# Altium schematic sheet Pg9-Hardware.SchDoc: Hardware - MIiscellaneous
size 431 x 279 mm; Date: Not shown in title block; ApprovedBy: Not shown in title block; CheckedBy: Not shown in title block; Author: Not shown in title block; CompanyName: Not shown in title block; Engineer: Not shown in title block; Organization: Not shown in title block; Address1: Not shown in title block; Address2: Not shown in title block; Address3: Not shown in title block; Address4: Not shown in title block; DocumentNumber: 7; Revision: Use project parameter SCH_Rev; SheetNumber: 9; SheetTotal: 9; PageSetup: Record=PageOptions|CenterHorizontal=True|CenterVertical=True|PrintScale=0.62|XCorrection=1.00|YCorrection=1.00|PrintKind=0|BorderSize=5000000|LeftOffset=0|BottomOffset=0|Orientation=2|PaperLength=1000|PaperWidth=1000|Scale=100|PaperSource=15|PrintQuality=600|MediaType=1|DitherType=10|PaperKind=Letter|PrintScaleMode=1; CurrentTime: Not shown in title block; CurrentDate: Not shown in title block; Time: Not shown in title block; DocumentFullPathAndName: Not shown in title block; DocumentName: Not shown in title block; ModifiedDate: Not shown in title block; ImagePath: Not shown in title block
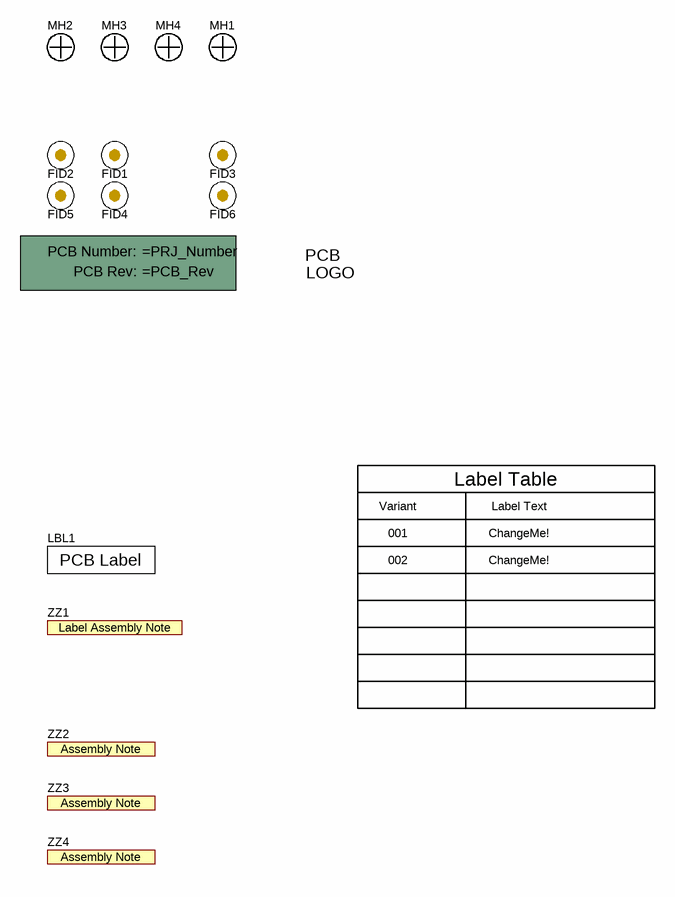
[diagram p0: Pg9-Hardware.SchDoc]

## Parts
!PCB1  (no value)  (mechanical)
FID1  (no value)  [Fiducial10-20]
FID2  (no value)  [Fiducial10-20]
FID3  (no value)  [Fiducial10-20]
FID4  (no value)  [Fiducial10-20]
FID5  (no value)  [Fiducial10-20]
FID6  (no value)  [Fiducial10-20]
LBL1  (no value)  [Label_650x200]
Logo1  (no value)  [TI_Stacked_SolderMask_Small]  (no BOM)
MH1  (no value)  [MH3.2]
MH2  (no value)  [MH3.2]
MH3  (no value)  [MH3.2]
MH4  (no value)  [MH3.2]
ZZ1  (no value)  [AssemblyNoteLabel]  (no BOM)
ZZ2  (no value)  [AssemblyNote]  (no BOM)
ZZ3  (no value)  [AssemblyNote]  (no BOM)
ZZ4  (no value)  [AssemblyNote]  (no BOM)

## Notes on the sheet
- Variant
- Label Table
- Label Text
- 001
- 002
- ChangeMe!
- Drawn By:
- SVN Rev:
- Number:
- Rev:
- Sheet Title:
- File:
- Project Title:
- Designed for:
- Assembly Variant:
- Mod. Date:
- Sheet:
- Size:
- of
- B
- http://www.ti.com
- Texas Instruments and/or its licensors do not warrant the accuracy or completeness of this specification or any information contained therein. Texas Instruments and/or its licensors do not warrant that this design will meet the specifications, will be suitable for your application or fit for any particular purpose, or will operate in an implementation. Texas Instruments and/or its licensors do not warrant that the design is production worthy. You should completely validate and test your design implementation to confirm the system functionality for your application.
- Engineer:
- Contact:
- © Texas Instruments
- (in symbol AssemblyNote) Assembly Note
- (in symbol AssemblyNoteLabel) Label Assembly Note
- (in symbol PCB) PCB Number:; PCB Rev:
- (in symbol THT-14-423-10) PCB Label
- (in symbol TI_Logo) PCB; LOGO

## Library data of the parts
!PCB1 = PCB: Printed Circuit Board; Manufacturer: Any; SymbolCreator: a0412235; SymbolVersion: 2012-05-30; CompType: PCB; PartNumber: =PRJ_Number; RoHS: O; MountType: N/A; Publisher: Texas Instruments; LatestRevisionDate: 2012-06-27; LatestRevisionNote: Initial Version; Alternate Manufacturer: -; Alternate PartNumber: -
FID1-FID6 = Fiducial: Fiducial mark.  There is nothing to buy or mount.; SymbolCreator: codlsc; SymbolVersion: 2009-11-4; CompType: Fiducial; Publisher: National Semiconductor; LatestRevisionDate: 2011-09-19; LatestRevisionNote: Added Alternate PartNumber and Alternate Manufacturer parameters to appropriate components.; ComponentLink1URL: Paste URL for datasheet here; Manufacturer: N/A; MountType: N/A; PackageReference: Fiducial; PartNumber: N/A; ClassName: FiducialMark
LBL1 = THT-14-423-10: Thermal Transfer Printable Labels, 0.650" W x 0.200" H - 10,000 per roll; Manufacturer: Brady; SymbolCreator: a0412235; CompType: Label; Note: Size: 0.65" x 0.20 "; SymbolVersion: 2012-06-12; ClassName: Label; PartNumber: THT-14-423-10; RoHS: Y; PackageReference: PCB Label 0.650"H x 0.200"W; MountType: N/A; ComponentLink1Description: Web Page; ComponentLink1URL: http://www.bradyid.com/bradyid/pdpv/THT-14-423-10.html; Publisher: Texas Instruments; LatestRevisionDate: 2012-07-31; LatestRevisionNote: Initial Version; Alternate Manufacturer: -; Alternate PartNumber: -; Supplier 1: Farnell; Supplier Part Number 1: 2065596; Supplier 2: Newark; Supplier Part Number 2: 97C5133
Logo1 = TI_Logo: Texas Instrument Corporate Signature; SymbolCreator: codlsc; SymbolVersion: 2011-08-22; Published: 2009-03-03; Publisher: National Semiconductor; ClassName: Logo; LatestRevisionDate: 2011-10-25; LatestRevisionNote: Added ClassName of Logo.
MH1-MH4 = NY PMS 440 0025 PH: Mountin hole, NPTH Drill 3.2mm; CompType: Hardware; MountType: N/A; RoHS: Y; PackageReference: Screw; ComponentLink1Description: Datasheet Link; ClassName: Mounting Holes; Alternate Manufacturer: -; Alternate PartNumber: -; Publisher: Texas Instruments
ZZ1 = AssemblyNoteLabel: This Assembly Note is for PCB labels only; SymbolCreator: a0412235; SymbolVersion: 2012-06-14; CompType: AssemblyNote; ClassName: AssemblyNote; Publisher: Texas Instruments; LatestRevisionDate: 2012-07-31; LatestRevisionNote: Initial Version; Alternate Manufacturer: -; Alternate PartNumber: -
ZZ2 = AssemblyNote: These assemblies are ESD sensitive, ESD precautions shall be observed.; SymbolCreator: codlsc; SymbolVersion: 2010-05-18; CompType: AssemblyNote; ClassName: AssemblyNote; Publisher: Texas Instruments; LatestRevisionDate: 2012-06-14; LatestRevisionNote: Initial Version; Alternate Manufacturer: -; Alternate PartNumber: -
ZZ3 = AssemblyNote: These assemblies must be clean and free from flux and all contaminants. Use of no clean flux is not acceptable.; SymbolCreator: codlsc; SymbolVersion: 2010-05-18; CompType: AssemblyNote; ClassName: AssemblyNote; Publisher: Texas Instruments; LatestRevisionDate: 2012-06-14; LatestRevisionNote: Initial Version; Alternate Manufacturer: -; Alternate PartNumber: -
ZZ4 = AssemblyNote: These assemblies must comply with workmanship standards IPC-A-610 Class 2, unless otherwise specified.; SymbolCreator: codlsc; SymbolVersion: 2010-05-18; CompType: AssemblyNote; ClassName: AssemblyNote; Publisher: Texas Instruments; LatestRevisionDate: 2012-06-14; LatestRevisionNote: Initial Version; Alternate Manufacturer: -; Alternate PartNumber: -